# Altium project Engineer_Control.PrjPCB
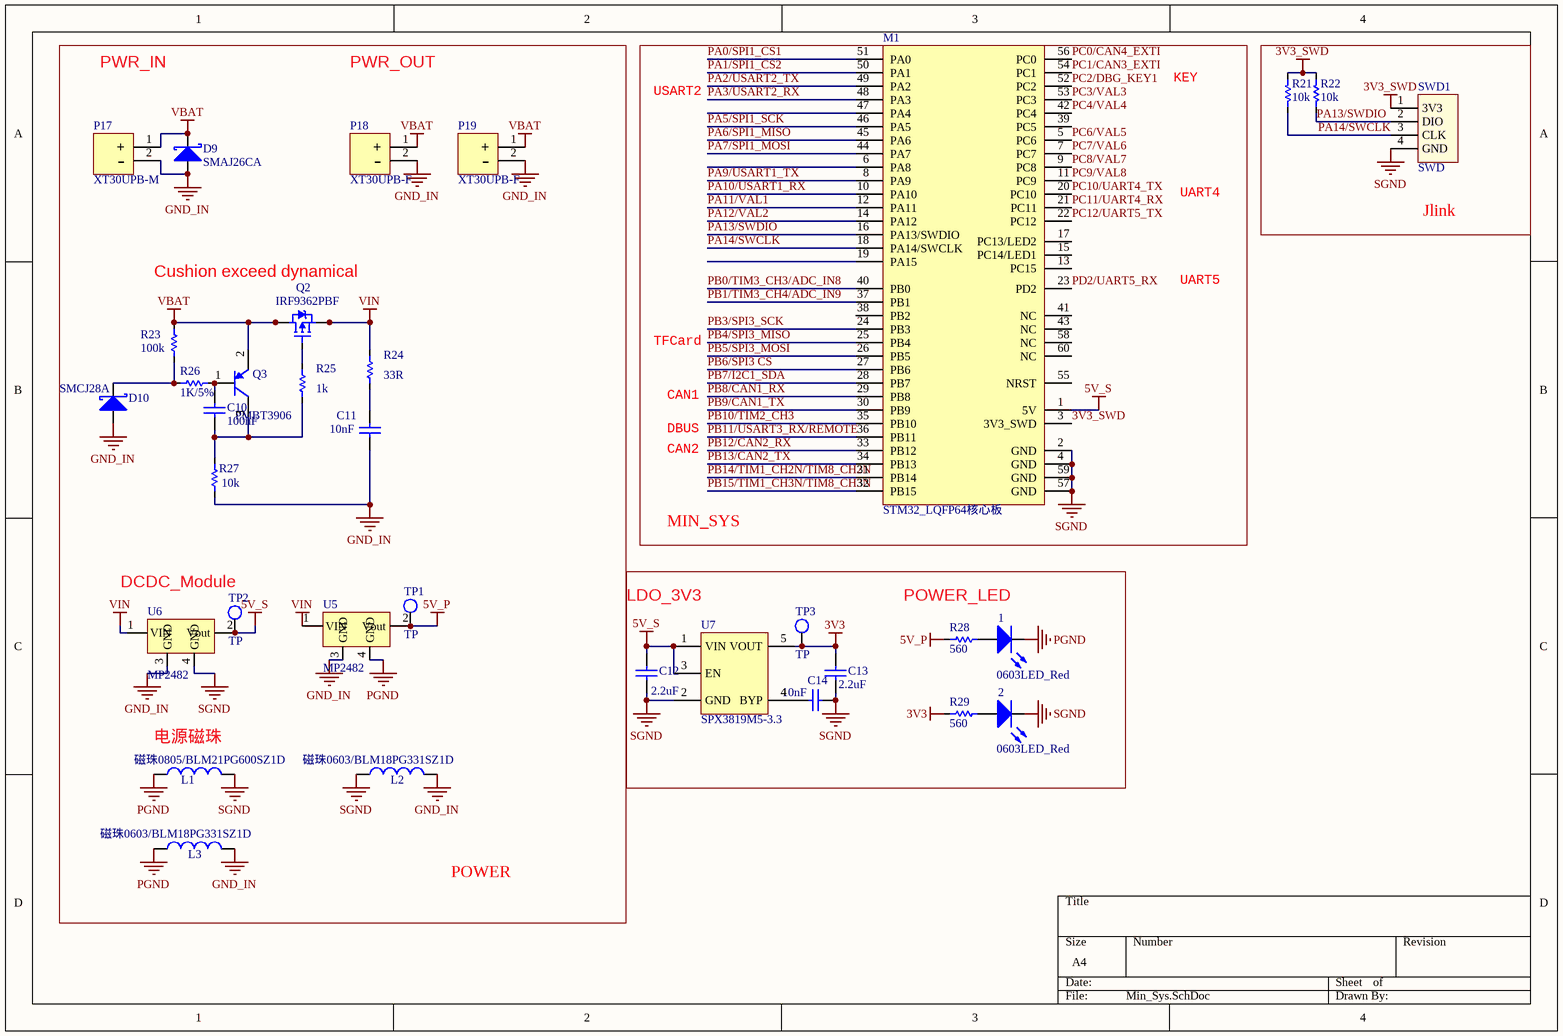
[diagram p0: Min_Sys.SchDoc]
3 sheets, 168 parts. Net scope: global (net labels, ports and power ports of the same name join across sheets).
Board file: Engineer_Control.PcbDoc
Sheets:
  Min_Sys.SchDoc
  Communication.SchDoc
  Peripheral.SchDoc

## Sheet Min_Sys.SchDoc
size A4

### Parts
1  0603LED_Red  [0603LED_R]
2  0603LED_Red  [0603LED_R]
C10  100nF  [0603C]
C11  10nF  [0603C]
C12  2.2uF  [0603C]
C13  2.2uF  [0603C]
C14  10nF  [0603C]
D9  SMAJ26CA  [SMA/DO-214AC]
D10  SMCJ28A  [SMA/DO-214AC]
L1  磁珠0805/BLM21PG600SZ1D  [0805L]
L2  磁珠0603/BLM18PG331SZ1D  [0603L]
L3  磁珠0603/BLM18PG331SZ1D  [0603L]
M1  STM32_LQFP64核心板  [STM32_LQFP64核心板]
P17  XT30UPB-M  [XT30UPB-MALE]
P18  XT30UPB-F  [XT30UPB-FEMALE]
P19  XT30UPB-F  [XT30UPB-FEMALE]
Q2  IRF9362PBF  [SON5X6]
Q3  PMBT3906  [SOT-23-3]
R21  10k  [0603R]
R22  10k  [0603R]
R23  100k  [0603R]
R24  33R  [0603R]
R25  1k  [0603R]
R26  1K/5%  [0603R]
R27  10k  [0603R]
R28  560  [0603R]
R29  560  [0603R]
SWD1  SWD  [HEADER 4x1]
TP1  TP  [TP_VIA]
TP2  TP  [TP_VIA]
TP3  TP  [TP_VIA]
U5  MP2482  [MP2482_PowerModule]
U6  MP2482  [MP2482_PowerModule]
U7  SPX3819M5-3.3  [SOT-23-5 L]

### Blocks framed on the sheet
MIN_SYS: M1
Jlink: R21 R22 SWD1

### Nets
3V3: C13.1 R29.2 TP3.1(TP) U7.5(VOUT)
3V3_SWD: M1.3(3V3_SWD) R21.2 R22.2 SWD1.1(3V3)
5V_P: R28.2 TP1.1(TP) U5.2(Vout)
5V_S: C12.2 M1.1(5V) TP2.1(TP) U6.2(Vout) U7.1(VIN) U7.3(EN)
GND_IN: C11.1 D9.1 D10.1 L2.2 L3.2 P17.2(-) P18.2(-) P19.2(-) R27.2 U5.3(GND) U6.3(GND)
PGND: 1.2 L1.1 L3.1 U5.4(GND)
SGND: 2.2 C12.1 C13.2 C14.1 L1.2 L2.1 M1.2(GND) M1.4(GND) M1.57(GND) M1.59(GND) SWD1.4(GND) U6.4(GND) U7.2(GND)
VBAT: D9.2 P17.1(+) P18.1(+) P19.1(+) Q2.5(D) Q2.6(D) Q2.7(D) Q2.8(D) Q2.9(D) Q3.2(E) R23.1
VIN: Q2.1(S) Q2.2(S) Q2.3(S) R24.1 U5.1(VIN) U6.1(VIN)
PA0/SPI1_CS1: M1.51(PA0)
PA1/SPI1_CS2: M1.50(PA1)
PA2/USART2_TX: M1.49(PA2)
PA3/USART2_RX: M1.48(PA3)
PA5/SPI1_SCK: M1.46(PA5)
PA6/SPI1_MISO: M1.45(PA6)
PA7/SPI1_MOSI: M1.44(PA7)
PA9/USART1_TX: M1.8(PA9)
PA10/USART1_RX: M1.10(PA10)
PA11/VAL1: M1.12(PA11)
PA12/VAL2: M1.14(PA12)
PA13/SWDIO: M1.16(PA13/SWDIO) R22.1 SWD1.2(DIO)
PA14/SWCLK: M1.18(PA14/SWCLK) R21.1 SWD1.3(CLK)
PB0/TIM3_CH3/ADC_IN8: M1.40(PB0)
PB1/TIM3_CH4/ADC_IN9: M1.37(PB1)
PB3/SPI3_SCK: M1.24(PB3)
PB4/SPI3_MISO: M1.25(PB4)
PB5/SPI3_MOSI: M1.26(PB5)
PB6/SPI3 CS: M1.27(PB6)
PB7/I2C1_SDA: M1.28(PB7)
PB8/CAN1_RX: M1.29(PB8)
PB9/CAN1_TX: M1.30(PB9)
PB10/TIM2_CH3: M1.35(PB10)
PB11/USART3_RX/REMOTE: M1.36(PB11)
PB12/CAN2_RX: M1.33(PB12)
PB13/CAN2_TX: M1.34(PB13)
PB14/TIM1_CH2N/TIM8_CH2N: M1.31(PB14)
PB15/TIM1_CH3N/TIM8_CH3N: M1.32(PB15)
PC0/CAN4_EXTI: M1.56(PC0)
PC1/CAN3_EXTI: M1.54(PC1)
PC2/DBG_KEY1: M1.52(PC2)
PC3/VAL3: M1.53(PC3)
PC4/VAL4: M1.42(PC4)
PC6/VAL5: M1.5(PC6)
PC7/VAL6: M1.7(PC7)
PC8/VAL7: M1.9(PC8)
PC9/VAL8: M1.11(PC9)
PC10/UART4_TX: M1.20(PC10)
PC11/UART4_RX: M1.21(PC11)
PC12/UART5_TX: M1.22(PC12)
PD2/UART5_RX: M1.23(PD2)
Net1_1: 1.1 R28.1
Net2_1: 2.1 R29.1
NetC10_1: C10.1 Q3.1(B) R26.2
NetC10_2: C10.2 Q3.3(C) R25.2 R27.1
NetC11_2: C11.2 R24.2
NetC14_2: C14.2 U7.4(BYP)
NetD10_2: D10.2 R23.2 R26.1
NetQ2_4: Q2.4(G) R25.1

Not connected (* = marked no-connect by the designer): M1 6(PA8) 13(PC15) 15(PC14/LED1) 17(PC13/LED2) 19(PA15) 38(PB2) 39(PC5) 41(NC) 43(NC) 47(PA4) 55(NRST) 58(NC) 60(NC)

### Notes on the sheet
- PWR_IN
- PWR_OUT
- USART2
- KEY
- UART4
- Cushion exceed dynamical
- UART5
- TFCard
- DBUS
- CAN1
- CAN2
- DCDC_Module
- LDO_3V3
- POWER_LED
- (near L1) 电源磁珠
- POWER

### Library data of the parts
1 2 = LED: Typical RED, GREEN, YELLOW, AMBER GaAs LED; Published: 8-Jun-2000; LatestRevisionDate: 17-Jul-2002; LatestRevisionNote: Re-released for DXP Platform.; PackageVersion: Feb-2002; PackageReference: 3.2X1.6X1.1; Publisher: Altium Limited; PackageDescription: SM LED; 2 Flat Leads
C10-C14 = Cap: Capacitor; Value: 100pF; Published: 8-Jun-2000; LatestRevisionDate: 17-Jul-2002; LatestRevisionNote: Re-released for DXP Platform.; PackageReference: RAD-0.3; Publisher: Altium Limited; PackageDescription: Radial Cap, Thru-Hole; 2 Leads; 0.3 in Pin Spacing
D9 D10 = D Schottky_SMAF: Schottky Diode; Published: 8-Jun-2000; LatestRevisionDate: 17-Jul-2002; LatestRevisionNote: Re-released for DXP Platform.; PackageReference: SMB; Publisher: Altium Limited; PackageDescription: DO-214-AA/SMB; 2 C-Bend Leads; Body 5.3 x 3.6 mm, inc. leads (LxW); Code_JEDEC: DO-214-AA
L1-L3 = Inductor: Code_IEC: 1005; Value: 10mH; Published: 8-Jun-2000; LatestRevisionDate: 29-May-2009; LatestRevisionNote: IPC-7351 Footprint Added.; PackageReference: 0402-A; Publisher: Altium Limited; PackageDescription: Chip Inductor; Code_JEITA: 0402
M1 = STM32_LQFP64核心板: STM32_LQFP64核心板 / 兼容F105Rx、F405RGT6、F446Rx / 尺寸23mm x 25mm
P17-P19 = XT30/60/90
Q2 = PMOS: P-Channel Power MOSFET; Note: Pin 4 not drawn and electrically connected to Pin 2.; Published: 8-Jun-2000; LatestRevisionDate: 17-Jul-2002; LatestRevisionNote: Re-released for DXP Platform.; DatasheetVersion: PD-9.390D; PackageVersion: Feb-1997; PackageReference: TO-220AB; Publisher: Altium Limited; PackageDescription: TO, Thru-Hole, Vertical, Heatsink Mounted; 3 In-Line Leads; Pitch 2.54 mm; ComponentLink1Description: Manufacturer Link; ComponentLink1URL: http://www.irf.com/
Q3 = PNP: PNP Bipolar Transistor; Published: 8-Jun-2000; LatestRevisionDate: 17-Jul-2002; LatestRevisionNote: Re-released for DXP Platform.; PackageReference: TO-226-AA; Publisher: Altium Limited; PackageDescription: TO, Flat Index; 3 In-Line, Axial Leads; Body Dia. 4.8mm; Leads 0.55 x 0.51 mm (max); Code_JEDEC: TO-226-AA
R21-R24 R26-R29 = Res1: Resistor; Value: 1K; Published: 8-Jun-2000; LatestRevisionDate: 17-Jul-2002; LatestRevisionNote: Re-released for DXP Platform.; PackageReference: AXIAL-0.3; Publisher: Altium Limited; PackageDescription: Axial Device, Thru-Hole; 2 Leads; 0.3 in Pin Spacing
R25 = Res1: Resistor; Published: 8-Jun-2000; LatestRevisionDate: 17-Jul-2002; LatestRevisionNote: Re-released for DXP Platform.; PackageReference: AXIAL-0.3; Publisher: Altium Limited; PackageDescription: Axial Device, Thru-Hole; 2 Leads; 0.3 in Pin Spacing; Value: 1K
SWD1 = SWD_HEADER
TP1-TP3 = TP: Test Point
U5 U6 = MP2482_PowerModule
U7 = LDO_SOT23-5

## Sheet Communication.SchDoc
size A4
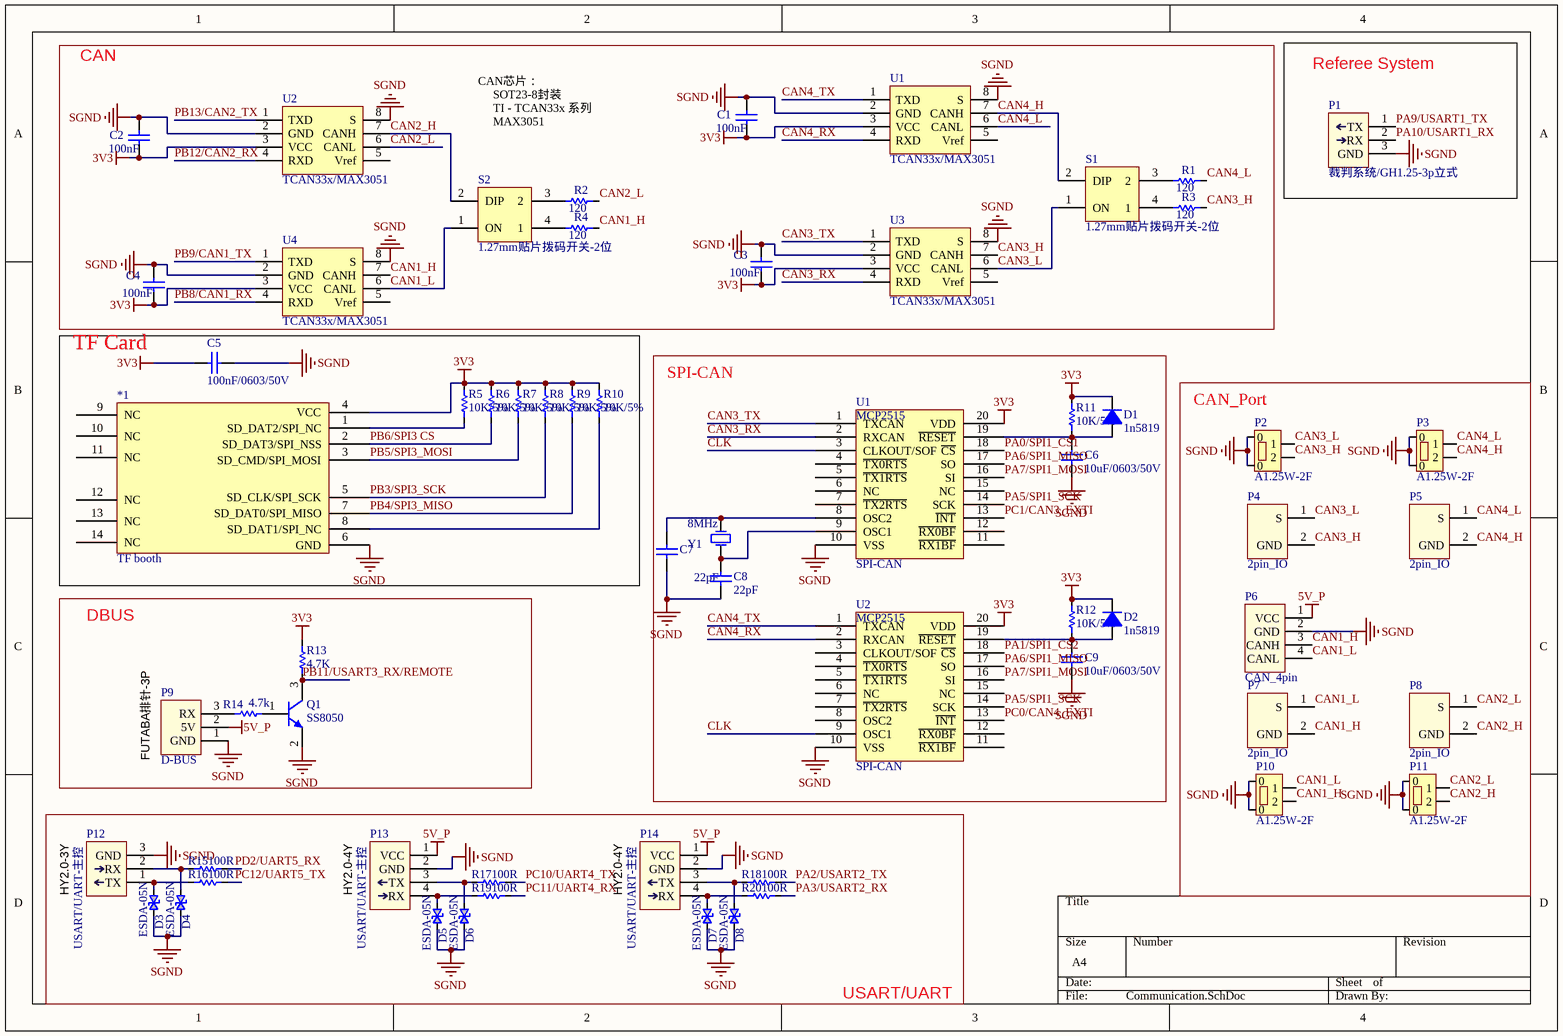
[diagram p1: Communication.SchDoc]

### Parts
(Parts that share a designator on the sheet are numbered #1, #2 ... from top to bottom, then left to right.)
*1  TF booth  [tf_booth]
C1  100nF  [0603C]
C2  100nF  [0603C]
C3  100nF  [0603C]
C4  100nF  [0603C]
C5  100nF/0603/50V  [0603C]
C6  10uF/0603/50V  [0603C]
C7  22pF  [0603C]
C8  22pF  [0603C]
C9  10uF/0603/50V  [0603C]
D1  1n5819  [SOD-323-]
D2  1n5819  [SOD-323-]
D3  ESDA-05N  [0603ESDA]
D4  ESDA-05N  [0603ESDA]
D5  ESDA-05N  [0603ESDA]
D6  ESDA-05N  [0603ESDA]
D7  ESDA-05N  [0603ESDA]
D8  ESDA-05N  [0603ESDA]
P1  裁判系统/GH1.25-3p立式  [A1254-03AWB]
P2  A1.25W-2F  [GH1.25-2P-立贴]
P3  A1.25W-2F  [GH1.25-2P-立贴]
P4  2pin_IO  [HY2.00MM 2X1_立式]
P5  2pin_IO  [HY2.00MM 2X1_立式]
P6  CAN_4pin  [HY2.00MM 4X1立式]
P7  2pin_IO  [HY2.00MM 2X1_立式]
P8  2pin_IO  [HY2.00MM 2X1_立式]
P9  D-BUS  [HY2.00MM 3x1立式]
P10  A1.25W-2F  [GH1.25-2P-立贴]
P11  A1.25W-2F  [GH1.25-2P-立贴]
P12  USART/UART-主控  [HY2.00MM 3x1立式]
P13  USART/UART-主控  [HY2.00MM 4X1立式]
P14  USART/UART-主控  [HY2.00MM 4X1立式]
Q1  SS8050  [SOT-23-3]
R1  120  [0603R]
R2  120  [0603R]
R3  120  [0603R]
R4  120  [0603R]
R5  10K/5%  [0603R]
R6  10K/5%  [0603R]
R7  10K/5%  [0603R]
R8  10K/5%  [0603R]
R9  10K/5%  [0603R]
R10  10K/5%  [0603R]
R11  10K/5%  [0603R]
R12  10K/5%  [0603R]
R13  4.7K  [0603R]
R14  4.7k  [0603R]
R15  100R  [0603R]
R16  100R  [0603R]
R17  100R  [0603R]
R18  100R  [0603R]
R19  100R  [0603R]
R20  100R  [0603R]
S1  1.27mm贴片拨码开关-2位  [SW_DIP_2x2]
S2  1.27mm贴片拨码开关-2位  [SW_DIP_2x2]
U1#1  TCAN33x/MAX3051  [SOT-23-8]
U1#2  SPI-CAN  [TSSOP20]
U2#1  TCAN33x/MAX3051  [SOT-23-8]
U2#2  SPI-CAN  [TSSOP20]
U3  TCAN33x/MAX3051  [SOT-23-8]
U4  TCAN33x/MAX3051  [SOT-23-8]
Y1  8MHz  [NX3225GD]

### Blocks framed on the sheet
CAN: C1-C4 R1-R4 S1 S2 U1#1 U2#1 U3 U4
Referee System: P1
TF Card: *1 C5 R5-R10
SPI-CAN: C6-C9 D1 D2 R11 R12 U1#2 U2#2 Y1
CAN_Port: P2-P8 P10 P11
DBUS: P9 Q1 R13 R14
USART/UART: D3-D8 P12-P14 R15-R20

### Nets
3V3: *1.4(VCC) C1.1 C2.1 C3.1 C4.1 C5.2 D1.2(K) D2.2(K) R5.2 R6.2 R7.2 R8.2 R9.2 R10.2 R11.2 R12.2 R13.2 U1#1.3(VCC) U1#2.20(VDD) U2#1.3(VCC) U2#2.20(VDD) U3.3(VCC) U4.3(VCC)
5V_P: P6.1(VCC) P9.2(5V) P13.1(VCC) P14.1(VCC)
SGND: *1.6(GND) C1.2 C2.2 C3.2 C4.2 C5.1 C6.1 C7.1 C8.1 C9.2 D3.1(V) D4.1(V) D5.1(V) D6.1(V) D7.1(V) D8.1(V) P1.3(GND) P2.0 P3.0 P6.2(GND) P9.1(GND) P10.0 P11.0 P12.3(GND) P13.2(GND) P14.2(GND) Q1.2(E) U1#1.2(GND) U1#1.8(S) U1#2.10(VSS) U2#1.2(GND) U2#1.8(S) U2#2.10(VSS) U3.2(GND) U3.8(S) U4.2(GND) U4.8(S)
CAN1_H: P6.3(CANH) P7.2(GND) P10.2 R4.1 U4.7(CANH)
CAN1_L: P6.4(CANL) P7.1(S) P10.1 S2.1(ON) U4.6(CANL)
CAN2_H: P8.2(GND) P11.2 S2.2(DIP) U2#1.7(CANH)
CAN2_L: P8.1(S) P11.1 R2.1 U2#1.6(CANL)
CAN3_H: P2.2 P4.2(GND) R3.1 U3.7(CANH)
CAN3_L: P2.1 P4.1(S) S1.1(ON) U3.6(CANL)
CAN3_RX: U1#2.2(RXCAN) U3.4(RXD)
CAN3_TX: U1#2.1(TXCAN) U3.1(TXD)
CAN4_H: P3.2 P5.2(GND) S1.2(DIP) U1#1.7(CANH)
CAN4_L: P3.1 P5.1(S) R1.1 U1#1.6(CANL)
CAN4_RX: U1#1.4(RXD) U2#2.2(RXCAN)
CAN4_TX: U1#1.1(TXD) U2#2.1(TXCAN)
CLK: U1#2.3(CLKOUT/SOF) U2#2.9(OSC1)
PA0/SPI1_CS1: U1#2.18(~{CS})
PA1/SPI1_CS2: U2#2.18(~{CS})
PA2/USART2_TX: R18.2
PA3/USART2_RX: R20.2
PA5/SPI1_SCK: U1#2.14(SCK) U2#2.14(SCK)
PA6/SPI1_MISO: U1#2.17(SO) U2#2.17(SO)
PA7/SPI1_MOSI: U1#2.16(SI) U2#2.16(SI)
PA9/USART1_TX: P1.1(TX)
PA10/USART1_RX: P1.2(RX)
PB3/SPI3_SCK: *1.5(SD_CLK/SPI_SCK) R8.1
PB4/SPI3_MISO: *1.7(SD_DAT0/SPI_MISO) R9.1
PB5/SPI3_MOSI: *1.3(SD_CMD/SPI_MOSI) R7.1
PB6/SPI3 CS: *1.2(SD_DAT3/SPI_NSS) R6.1
PB8/CAN1_RX: U4.4(RXD)
PB9/CAN1_TX: U4.1(TXD)
PB11/USART3_RX/REMOTE: Q1.3(C) R13.1
PB12/CAN2_RX: U2#1.4(RXD)
PB13/CAN2_TX: U2#1.1(TXD)
PC0/CAN4_EXTI: U2#2.13(~{INT})
PC1/CAN3_EXTI: U1#2.13(~{INT})
PC10/UART4_TX: R17.2
PC11/UART4_RX: R19.2
PC12/UART5_TX: R16.2
PD2/UART5_RX: R15.2
Net*1_1: *1.1(SD_DAT2/SPI_NC) R5.1
Net*1_8: *1.8(SD_DAT1/SPI_NC) R10.1
NetC6_2: C6.2 D1.1(A) R11.1 U1#2.19(~{RESET})
NetC7_2: C7.2 U1#2.8(OSC2) Y1.2(OSC2)
NetC8_2: C8.2 U1#2.9(OSC1) Y1.1(OSC1)
NetC9_1: C9.1 D2.1(A) R12.1 U2#2.19(~{RESET})
NetD3_2: D3.2(G) P12.1(TX) R16.1
NetD4_2: D4.2(G) P12.2(RX) R15.1
NetD5_2: D5.2(G) P13.4(RX) R19.1
NetD6_2: D6.2(G) P13.3(TX) R17.1
NetD7_2: D7.2(G) P14.4(RX) R20.1
NetD8_2: D8.2(G) P14.3(TX) R18.1
NetP9_3: P9.3(RX) R14.1
NetQ1_1: Q1.1(B) R14.2
NetR1_2: R1.2 S1.3(2)
NetR2_2: R2.2 S2.3(2)
NetR3_2: R3.2 S1.4(1)
NetR4_2: R4.2 S2.4(1)

Not connected (* = marked no-connect by the designer): *1 9(NC) 10(NC) 11(NC) 12(NC) 13(NC) 14(NC); U1#1 5(Vref); U1#2 4(~{TX0RTS}) 5(~{TX1RTS}) 6(NC) 7(~{TX2RTS}) 11(~{RX1BF}) 12(~{RX0BF}) 15(NC); U2#1 5(Vref); U2#2 3(CLKOUT/SOF) 4(~{TX0RTS}) 5(~{TX1RTS}) 6(NC) 7(~{TX2RTS}) 8(OSC2) 11(~{RX1BF}) 12(~{RX0BF}) 15(NC); U3 5(Vref); U4 5(Vref)

### Notes on the sheet
- CAN芯片：
  SOT23-8封装
  TI - TCAN33x 系列
  MAX3051
- (near P9) FUTABA排针-3P
- HY2.0-3Y
- HY2.0-4Y

### Library data of the parts
C1-C9 = Cap: Capacitor; Value: 100pF; Published: 8-Jun-2000; LatestRevisionDate: 17-Jul-2002; LatestRevisionNote: Re-released for DXP Platform.; PackageReference: RAD-0.3; Publisher: Altium Limited; PackageDescription: Radial Cap, Thru-Hole; 2 Leads; 0.3 in Pin Spacing
D1 D2 = Diode: Default Diode; Published: 8-Jun-2000; LatestRevisionDate: 17-Jul-2002; LatestRevisionNote: Re-released for DXP Platform.; PackageVersion: Sep-1996; PackageReference: SMC; Publisher: Altium Limited; PackageDescription: DO-214-AB/SMC; 2 C-Bend Leads; Body 7.9 x 5.9 mm, inc. leads (LxW); Code_JEDEC: DO-214-AB
D3-D8 = ESDA
P1 = UART_3pin
P2 P3 P10 P11 = GH1.25-2P
P6 = CAN_4pin: CAN 4pin，带5V电源，HY2.0-4A
P12 = UART_3pin_主控: Reference: UART_3pin_主控
P13 P14 = UART_4pin_主控: 带电源串口
Q1 = NPN: NPN Bipolar Transistor; Published: 8-Jun-2000; LatestRevisionDate: 17-Jul-2002; LatestRevisionNote: Re-released for DXP Platform.; PackageReference: TO-226-AA; Publisher: Altium Limited; PackageDescription: TO, Flat Index; 3 In-Line, Axial Leads; Body Dia. 4.8mm; Leads 0.55 x 0.51 mm (max); Code_JEDEC: TO-226-AA
R1-R20 = Res1: Resistor; Value: 1K; Published: 8-Jun-2000; LatestRevisionDate: 17-Jul-2002; LatestRevisionNote: Re-released for DXP Platform.; PackageReference: AXIAL-0.3; Publisher: Altium Limited; PackageDescription: Axial Device, Thru-Hole; 2 Leads; 0.3 in Pin Spacing
S1 S2 = SW_DIP 2
U1#1 U2#1 U3 U4 = CAN
U1#2 U2#2 = MCP2515
Y1 = XTAL: Crystal Oscillator; Published: 8-Jun-2000; LatestRevisionDate: 17-Jul-2002; LatestRevisionNote: Re-released for DXP Platform.; PackageReference: R38; Publisher: Altium Limited; PackageDescription: Crystal, Thru-Hole; 2 Leads; Body 3.1 x 8.2 mm (Dia.xH)

## Sheet Peripheral.SchDoc
size A4
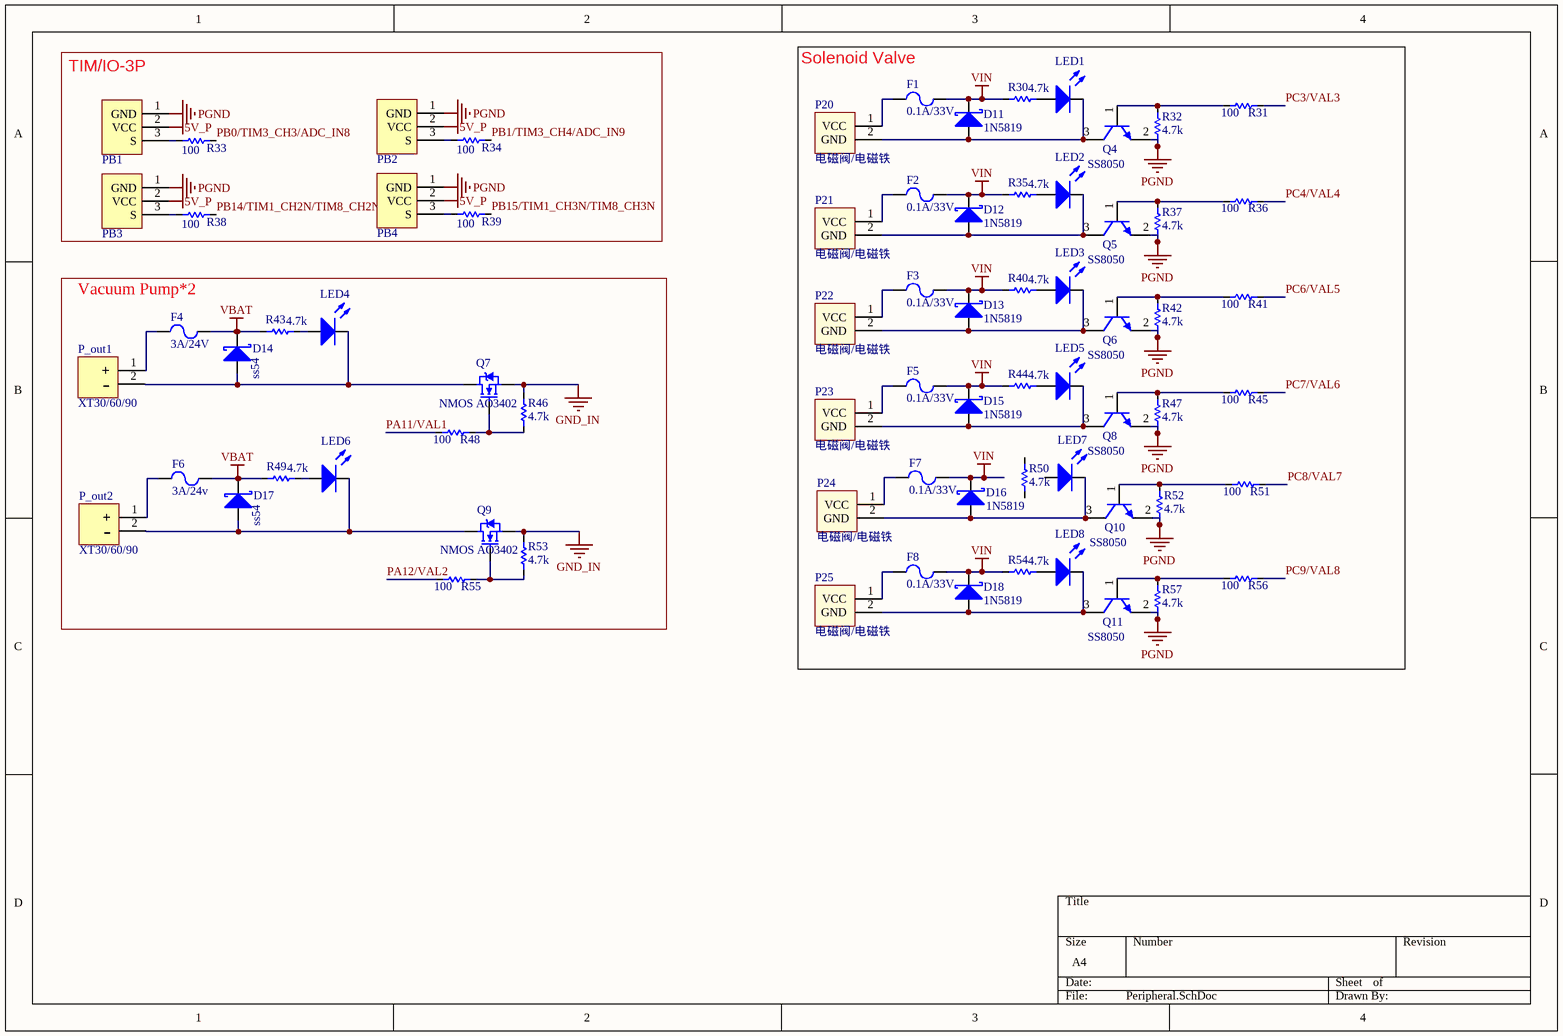
[diagram p2: Peripheral.SchDoc]

### Parts
D11  1N5819  [SOD-323-]
D12  1N5819  [SOD-323-]
D13  1N5819  [SOD-323-]
D14  ss54  [SMAF/DO-214AC]
D15  1N5819  [SOD-323-]
D16  1N5819  [SOD-323-]
D17  ss54  [SMAF/DO-214AC]
D18  1N5819  [SOD-323-]
F1  0.1A/33V  [0603C]
F2  0.1A/33V  [0603C]
F3  0.1A/33V  [0603C]
F4  3A/24V  [0603C]
F5  0.1A/33V  [0603C]
F6  3A/24v  [0603C]
F7  0.1A/33V  [0603C]
F8  0.1A/33V  [0603C]
LED1  LED_RED  [0603LED_B]  (value not drawn)
LED2  LED_RED  [0603LED_B]  (value not drawn)
LED3  LED_RED  [0603LED_B]  (value not drawn)
LED4  LED_RED  [0603LED_B]  (value not drawn)
LED5  LED_RED  [0603LED_B]  (value not drawn)
LED6  LED_RED  [0603LED_B]  (value not drawn)
LED7  LED_RED  [0603LED_B]  (value not drawn)
LED8  LED_RED  [0603LED_B]  (value not drawn)
P20  电磁阀/电磁铁  [HY2.00MM 2X1_立式]
P21  电磁阀/电磁铁  [HY2.00MM 2X1_立式]
P22  电磁阀/电磁铁  [HY2.00MM 2X1_立式]
P23  电磁阀/电磁铁  [HY2.00MM 2X1_立式]
P24  电磁阀/电磁铁  [HY2.00MM 2X1_立式]
P25  电磁阀/电磁铁  [HY2.00MM 2X1_立式]
P_out1  XT30/60/90  [XT30UPB-FEMALE]
P_out2  XT30/60/90  [XT30UPB-FEMALE]
PB1  3Pin_IO  [HY2.00MM 3x1立式]  (value not drawn)
PB2  3Pin_IO  [HY2.00MM 3x1立式]  (value not drawn)
PB3  3Pin_IO  [HY2.00MM 3x1立式]  (value not drawn)
PB4  3Pin_IO  [HY2.00MM 3x1立式]  (value not drawn)
Q4  SS8050  [SOT-23-3]
Q5  SS8050  [SOT-23-3]
Q6  SS8050  [SOT-23-3]
Q7  NMOS AO3402  [SOT-23-3]
Q8  SS8050  [SOT-23-3]
Q9  NMOS AO3402  [SOT-23-3]
Q10  SS8050  [SOT-23-3]
Q11  SS8050  [SOT-23-3]
R30  4.7k  [0603R]
R31  100  [0603R]
R32  4.7k  [0603R]
R33  100  [0603R]
R34  100  [0603R]
R35  4.7k  [0603R]
R36  100  [0603R]
R37  4.7k  [0603R]
R38  100  [0603R]
R39  100  [0603R]
R40  4.7k  [0603R]
R41  100  [0603R]
R42  4.7k  [0603R]
R43  4.7k  [0603R]
R44  4.7k  [0603R]
R45  100  [0603R]
R46  4.7k  [0603R]
R47  4.7k  [0603R]
R48  100  [0603R]
R49  4.7k  [0603R]
R50  4.7k  [0603R]
R51  100  [0603R]
R52  4.7k  [0603R]
R53  4.7k  [0603R]
R54  4.7k  [0603R]
R55  100  [0603R]
R56  100  [0603R]
R57  4.7k  [0603R]

### Blocks framed on the sheet
TIM/IO-3P: PB1-PB4 R33 R34 R38 R39
Solenoid Valve: D11-D13 D15 D16 D18 F1-F3 F5 F7 F8 LED1-LED3 LED5 LED7 LED8 P20-P25 Q4-Q6 Q8 Q10 Q11 R30-R32 R35-R37 R40-R42 R44 R45 R47 R50-R52 R54 R56 R57
Vacuum Pump*2: D14 D17 F4 F6 LED4 LED6 P_out1 P_out2 Q7 Q9 R43 R46 R48 R49 R53 R55

### Nets
5V_P: PB1.2(VCC) PB2.2(VCC) PB3.2(VCC) PB4.2(VCC)
GND_IN: Q7.2(S) Q9.2(S) R46.2 R53.2
PGND: PB1.1(GND) PB2.1(GND) PB3.1(GND) PB4.1(GND) Q4.2(E) Q5.2(E) Q6.2(E) Q8.2(E) Q10.2(E) Q11.2(E) R32.1 R37.1 R42.1 R47.1 R52.1 R57.1
VBAT: D14.2 D17.2 F4.2 F6.2 R43.1 R49.1
VIN: D11.2 D12.2 D13.2 D15.2 D16.2 D18.2 F1.2 F2.2 F3.2 F5.2 F7.2 F8.2 R30.1 R35.1 R40.1 R44.1 R54.1
PA11/VAL1: R48.1
PA12/VAL2: R55.1
PB0/TIM3_CH3/ADC_IN8: R33.2
PB1/TIM3_CH4/ADC_IN9: R34.2
PB14/TIM1_CH2N/TIM8_CH2N: R38.2
PB15/TIM1_CH3N/TIM8_CH3N: R39.2
PC3/VAL3: R31.2
PC4/VAL4: R36.2
PC6/VAL5: R41.2
PC7/VAL6: R45.2
PC8/VAL7: R51.2
PC9/VAL8: R56.2
NetD11_1: D11.1 LED1.2 P20.2(GND) Q4.3(C)
NetD12_1: D12.1 LED2.2 P21.2(GND) Q5.3(C)
NetD13_1: D13.1 LED3.2 P22.2(GND) Q6.3(C)
NetD14_1: D14.1 LED4.2 P_out1.2(-) Q7.3(D)
NetD15_1: D15.1 LED5.2 P23.2(GND) Q8.3(C)
NetD16_1: D16.1 LED7.2 P24.2(GND) Q10.3(C)
NetD17_1: D17.1 LED6.2 P_out2.2(-) Q9.3(D)
NetD18_1: D18.1 LED8.2 P25.2(GND) Q11.3(C)
NetF1_1: F1.1 P20.1(VCC)
NetF2_1: F2.1 P21.1(VCC)
NetF3_1: F3.1 P22.1(VCC)
NetF4_1: F4.1 P_out1.1(+)
NetF5_1: F5.1 P23.1(VCC)
NetF6_1: F6.1 P_out2.1(+)
NetF7_1: F7.1 P24.1(VCC)
NetF8_1: F8.1 P25.1(VCC)
NetLED1_1: LED1.1 R30.2
NetLED2_1: LED2.1 R35.2
NetLED3_1: LED3.1 R40.2
NetLED4_1: LED4.1 R43.2
NetLED5_1: LED5.1 R44.2
NetLED6_1: LED6.1 R49.2
NetLED8_1: LED8.1 R54.2
NetPB1_3: PB1.3(S) R33.1
NetPB2_3: PB2.3(S) R34.1
NetPB3_3: PB3.3(S) R38.1
NetPB4_3: PB4.3(S) R39.1
NetQ4_1: Q4.1(B) R31.1 R32.2
NetQ5_1: Q5.1(B) R36.1 R37.2
NetQ6_1: Q6.1(B) R41.1 R42.2
NetQ7_1: Q7.1(G) R46.1 R48.2
NetQ8_1: Q8.1(B) R45.1 R47.2
NetQ9_1: Q9.1(G) R53.1 R55.2
NetQ10_1: Q10.1(B) R51.1 R52.2
NetQ11_1: Q11.1(B) R56.1 R57.2

Not connected (* = marked no-connect by the designer): LED7 1; R50 1 2

### Library data of the parts
D11-D13 D15 D16 D18 = D Schottky: Schottky Diode; Published: 8-Jun-2000; LatestRevisionDate: 17-Jul-2002; LatestRevisionNote: Re-released for DXP Platform.; PackageReference: SMB; Publisher: Altium Limited; PackageDescription: DO-214-AA/SMB; 2 C-Bend Leads; Body 5.3 x 3.6 mm, inc. leads (LxW); Code_JEDEC: DO-214-AA
D14 D17 = D Schottky_SOD323: Schottky Diode; Published: 8-Jun-2000; LatestRevisionDate: 17-Jul-2002; LatestRevisionNote: Re-released for DXP Platform.; PackageReference: SMB; Publisher: Altium Limited; PackageDescription: DO-214-AA/SMB; 2 C-Bend Leads; Body 5.3 x 3.6 mm, inc. leads (LxW); Code_JEDEC: DO-214-AA
F1-F8 = Finance: 0603自恢复保险丝
LED1-LED8 = LED: as 1 on sheet Min_Sys; Published: 8-Jun-2000; LatestRevisionDate: 17-Jul-2002; LatestRevisionNote: Re-released for DXP Platform.; PackageVersion: Feb-2002; PackageReference: 3.2X1.6X1.1; Publisher: Altium Limited; PackageDescription: SM LED; 2 Flat Leads
PB1-PB4 = 3Pin_IO: 3pin input/output. V+S+G
Q4-Q6 Q8 Q10 Q11 = NPN: NPN Bipolar Transistor; Published: 8-Jun-2000; LatestRevisionDate: 17-Jul-2002; LatestRevisionNote: Re-released for DXP Platform.; PackageReference: TO-226-AA; Publisher: Altium Limited; PackageDescription: TO, Flat Index; 3 In-Line, Axial Leads; Body Dia. 4.8mm; Leads 0.55 x 0.51 mm (max); Code_JEDEC: TO-226-AA
Q7 Q9 = NMOS(SOT23): N-Channel Power MOSFET; Note: Pin 2 is electrically connected to pin 4.; Published: 8-Jun-2000; LatestRevisionDate: 17-Jul-2002; LatestRevisionNote: Re-released for DXP Platform.; DatasheetVersion: PD-9.814; PackageVersion: Feb-1997; PackageReference: TO-220AB; Publisher: Altium Limited; PackageDescription: TO, Thru-Hole, Vertical, Heatsink Mounted; 3 In-Line Leads; Pitch 2.54 mm; ComponentLink1Description: Manufacturer Link; ComponentLink1URL: http://www.irf.com/
R30 R31 R33-R36 R38-R41 R43-R45 R48-R51 R54-R56 = Res1: Resistor; Value: 1K; Published: 8-Jun-2000; LatestRevisionDate: 17-Jul-2002; LatestRevisionNote: Re-released for DXP Platform.; PackageReference: AXIAL-0.3; Publisher: Altium Limited; PackageDescription: Axial Device, Thru-Hole; 2 Leads; 0.3 in Pin Spacing
R32 R37 R42 R46 R47 R52 R53 R57 = Res1: Resistor; Published: 8-Jun-2000; LatestRevisionDate: 17-Jul-2002; LatestRevisionNote: Re-released for DXP Platform.; PackageReference: AXIAL-0.3; Publisher: Altium Limited; PackageDescription: Axial Device, Thru-Hole; 2 Leads; 0.3 in Pin Spacing; Value: 4.7k

## Nets that join several sheets
3V3: Min_Sys (C13.1 R29.2 TP3.1 U7.5), Communication (23 pins)
5V_P: Min_Sys (R28.2 TP1.1 U5.2), Communication (P6.1 P9.2 P13.1 P14.1), Peripheral (PB1.2 PB2.2 PB3.2 PB4.2)
GND_IN: Min_Sys (11 pins), Peripheral (Q7.2 Q9.2 R46.2 R53.2)
PGND: Min_Sys (1.2 L1.1 L3.1 U5.4), Peripheral (16 pins)
SGND: Min_Sys (13 pins), Communication (37 pins)
VBAT: Min_Sys (11 pins), Peripheral (6 pins)
VIN: Min_Sys (6 pins), Peripheral (17 pins)
PA0/SPI1_CS1: Min_Sys (M1.51), Communication (U1#2.18)
PA1/SPI1_CS2: Min_Sys (M1.50), Communication (U2#2.18)
PA2/USART2_TX: Min_Sys (M1.49), Communication (R18.2)
PA3/USART2_RX: Min_Sys (M1.48), Communication (R20.2)
PA5/SPI1_SCK: Min_Sys (M1.46), Communication (U1#2.14 U2#2.14)
PA6/SPI1_MISO: Min_Sys (M1.45), Communication (U1#2.17 U2#2.17)
PA7/SPI1_MOSI: Min_Sys (M1.44), Communication (U1#2.16 U2#2.16)
PA9/USART1_TX: Min_Sys (M1.8), Communication (P1.1)
PA10/USART1_RX: Min_Sys (M1.10), Communication (P1.2)
PA11/VAL1: Min_Sys (M1.12), Peripheral (R48.1)
PA12/VAL2: Min_Sys (M1.14), Peripheral (R55.1)
PB0/TIM3_CH3/ADC_IN8: Min_Sys (M1.40), Peripheral (R33.2)
PB1/TIM3_CH4/ADC_IN9: Min_Sys (M1.37), Peripheral (R34.2)
PB3/SPI3_SCK: Min_Sys (M1.24), Communication (*1.5 R8.1)
PB4/SPI3_MISO: Min_Sys (M1.25), Communication (*1.7 R9.1)
PB5/SPI3_MOSI: Min_Sys (M1.26), Communication (*1.3 R7.1)
PB6/SPI3 CS: Min_Sys (M1.27), Communication (*1.2 R6.1)
PB8/CAN1_RX: Min_Sys (M1.29), Communication (U4.4)
PB9/CAN1_TX: Min_Sys (M1.30), Communication (U4.1)
PB11/USART3_RX/REMOTE: Min_Sys (M1.36), Communication (Q1.3 R13.1)
PB12/CAN2_RX: Min_Sys (M1.33), Communication (U2#1.4)
PB13/CAN2_TX: Min_Sys (M1.34), Communication (U2#1.1)
PB14/TIM1_CH2N/TIM8_CH2N: Min_Sys (M1.31), Peripheral (R38.2)
PB15/TIM1_CH3N/TIM8_CH3N: Min_Sys (M1.32), Peripheral (R39.2)
PC0/CAN4_EXTI: Min_Sys (M1.56), Communication (U2#2.13)
PC1/CAN3_EXTI: Min_Sys (M1.54), Communication (U1#2.13)
PC3/VAL3: Min_Sys (M1.53), Peripheral (R31.2)
PC4/VAL4: Min_Sys (M1.42), Peripheral (R36.2)
PC6/VAL5: Min_Sys (M1.5), Peripheral (R41.2)
PC7/VAL6: Min_Sys (M1.7), Peripheral (R45.2)
PC8/VAL7: Min_Sys (M1.9), Peripheral (R51.2)
PC9/VAL8: Min_Sys (M1.11), Peripheral (R56.2)
PC10/UART4_TX: Min_Sys (M1.20), Communication (R17.2)
PC11/UART4_RX: Min_Sys (M1.21), Communication (R19.2)
PC12/UART5_TX: Min_Sys (M1.22), Communication (R16.2)
PD2/UART5_RX: Min_Sys (M1.23), Communication (R15.2)